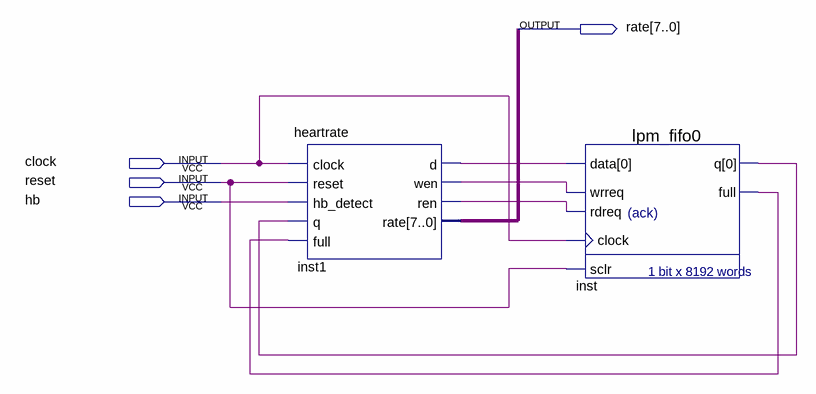
[diagram p0: schematic sheet]
// Quartus schematic top.bdf as structural Verilog: 2 symbols, 4 pins
module top (
  input  clock,
  input  reset,
  input  hb,
  output [7:0] rate
);

  wire inst1_d, inst1_ren, inst1_wen, inst_full, inst_q;

  heartrate inst1 (
    .clock(clock), .reset(reset), .hb_detect(hb), .q(inst_q), .full(inst_full), .d(inst1_d), .wen(inst1_wen),
    .ren(inst1_ren), .rate(rate));
  lpm_fifo0 inst (
    .data(inst1_d), .wrreq(inst1_wen), .rdreq(inst1_ren), .clock(clock), .sclr(reset), .q(inst_q),
    .full(inst_full));
endmodule
